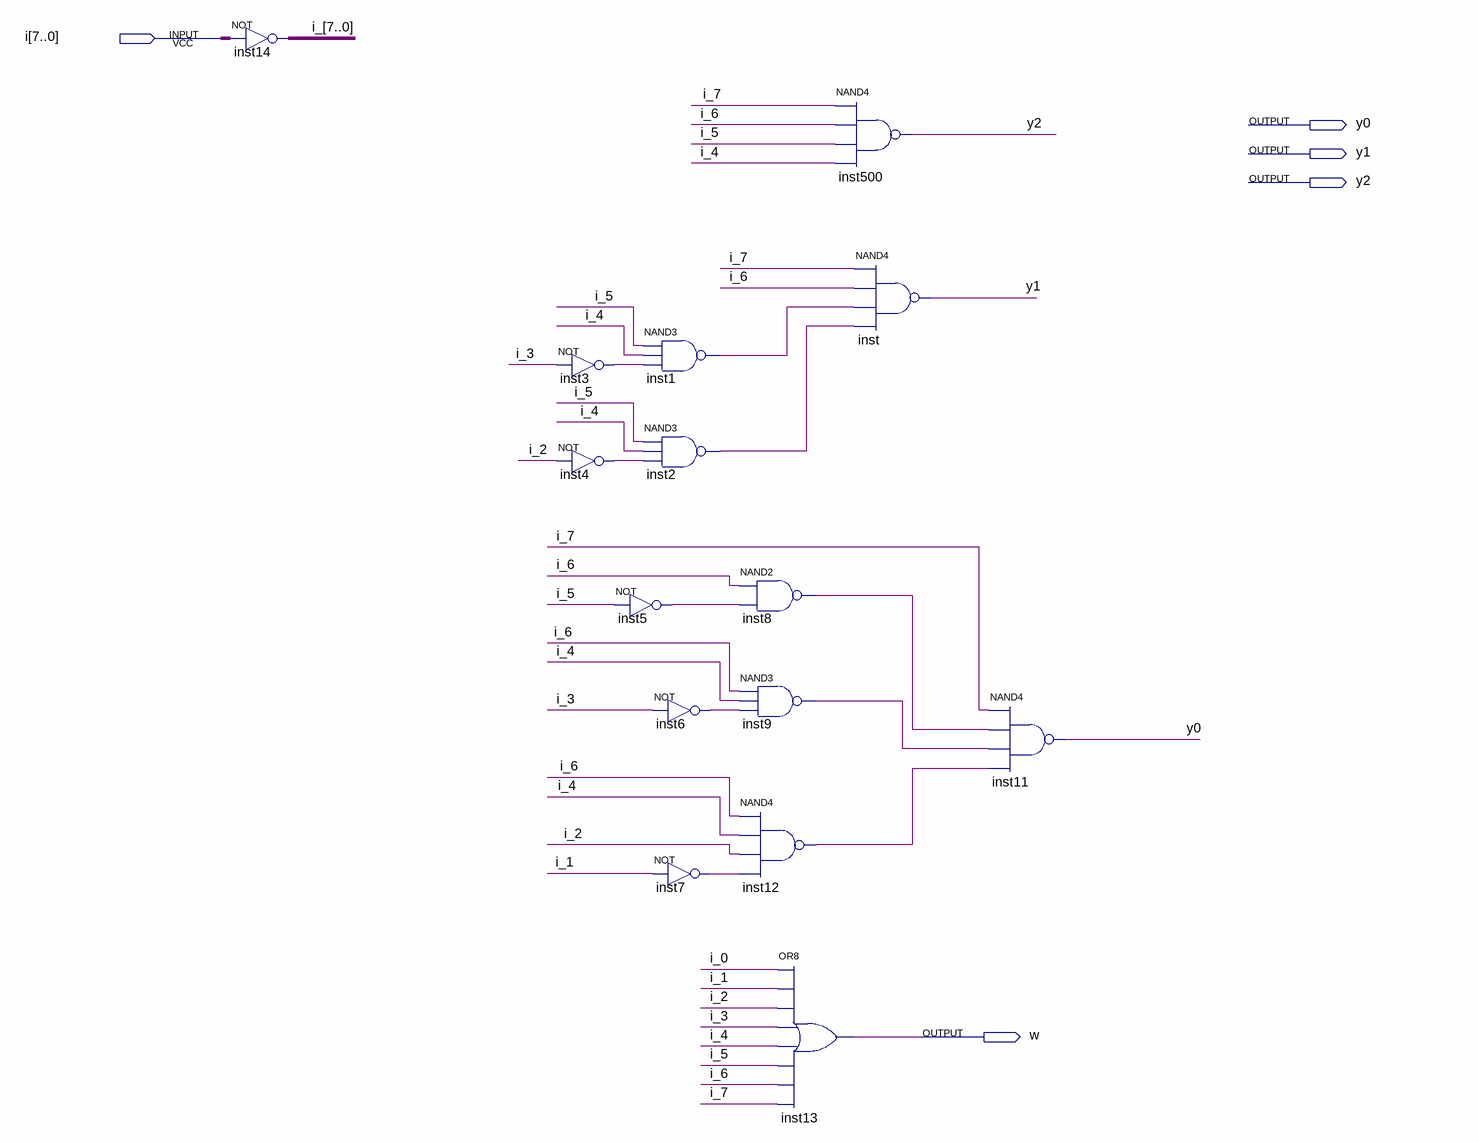
[diagram p0: schematic sheet]
// Quartus schematic pCD8.bdf as structural Verilog: 15 symbols, 5 pins
module pCD8 (
  input  [7:0] i,
  output y0,
  output y1,
  output y2,
  output w
);

  wire inst1_out, inst2_out, inst3_out, inst4_out, inst5_out, inst6_out, inst7_out, inst8_out, inst9_out,
       inst12_out;
  wire [7:0] i_;

  assign i_ = ~i;  // NOT inst14, 8 bits wide
  not inst3 (inst3_out, i_[3]);
  not inst4 (inst4_out, i_[2]);
  nand inst1 (inst1_out, i_[5], i_[4], inst3_out);
  nand inst2 (inst2_out, i_[5], i_[4], inst4_out);
  not inst5 (inst5_out, i_[5]);
  not inst6 (inst6_out, i_[3]);
  not inst7 (inst7_out, i_[1]);
  nand inst8 (inst8_out, i_[6], inst5_out);
  nand inst9 (inst9_out, i_[6], i_[4], inst6_out);
  nand inst12 (inst12_out, i_[6], i_[4], i_[2], inst7_out);
  nand inst500 (y2, i_[7], i_[6], i_[5], i_[4]);
  or inst13 (w, i_[0], i_[1], i_[2], i_[3], i_[4], i_[5], i_[6], i_[7]);
  nand inst (y1, i_[7], i_[6], inst1_out, inst2_out);
  nand inst11 (y0, i_[7], inst8_out, inst9_out, inst12_out);
endmodule
